# EAGLE board ALU (EAGLE 9.6.2), part 1 of 2
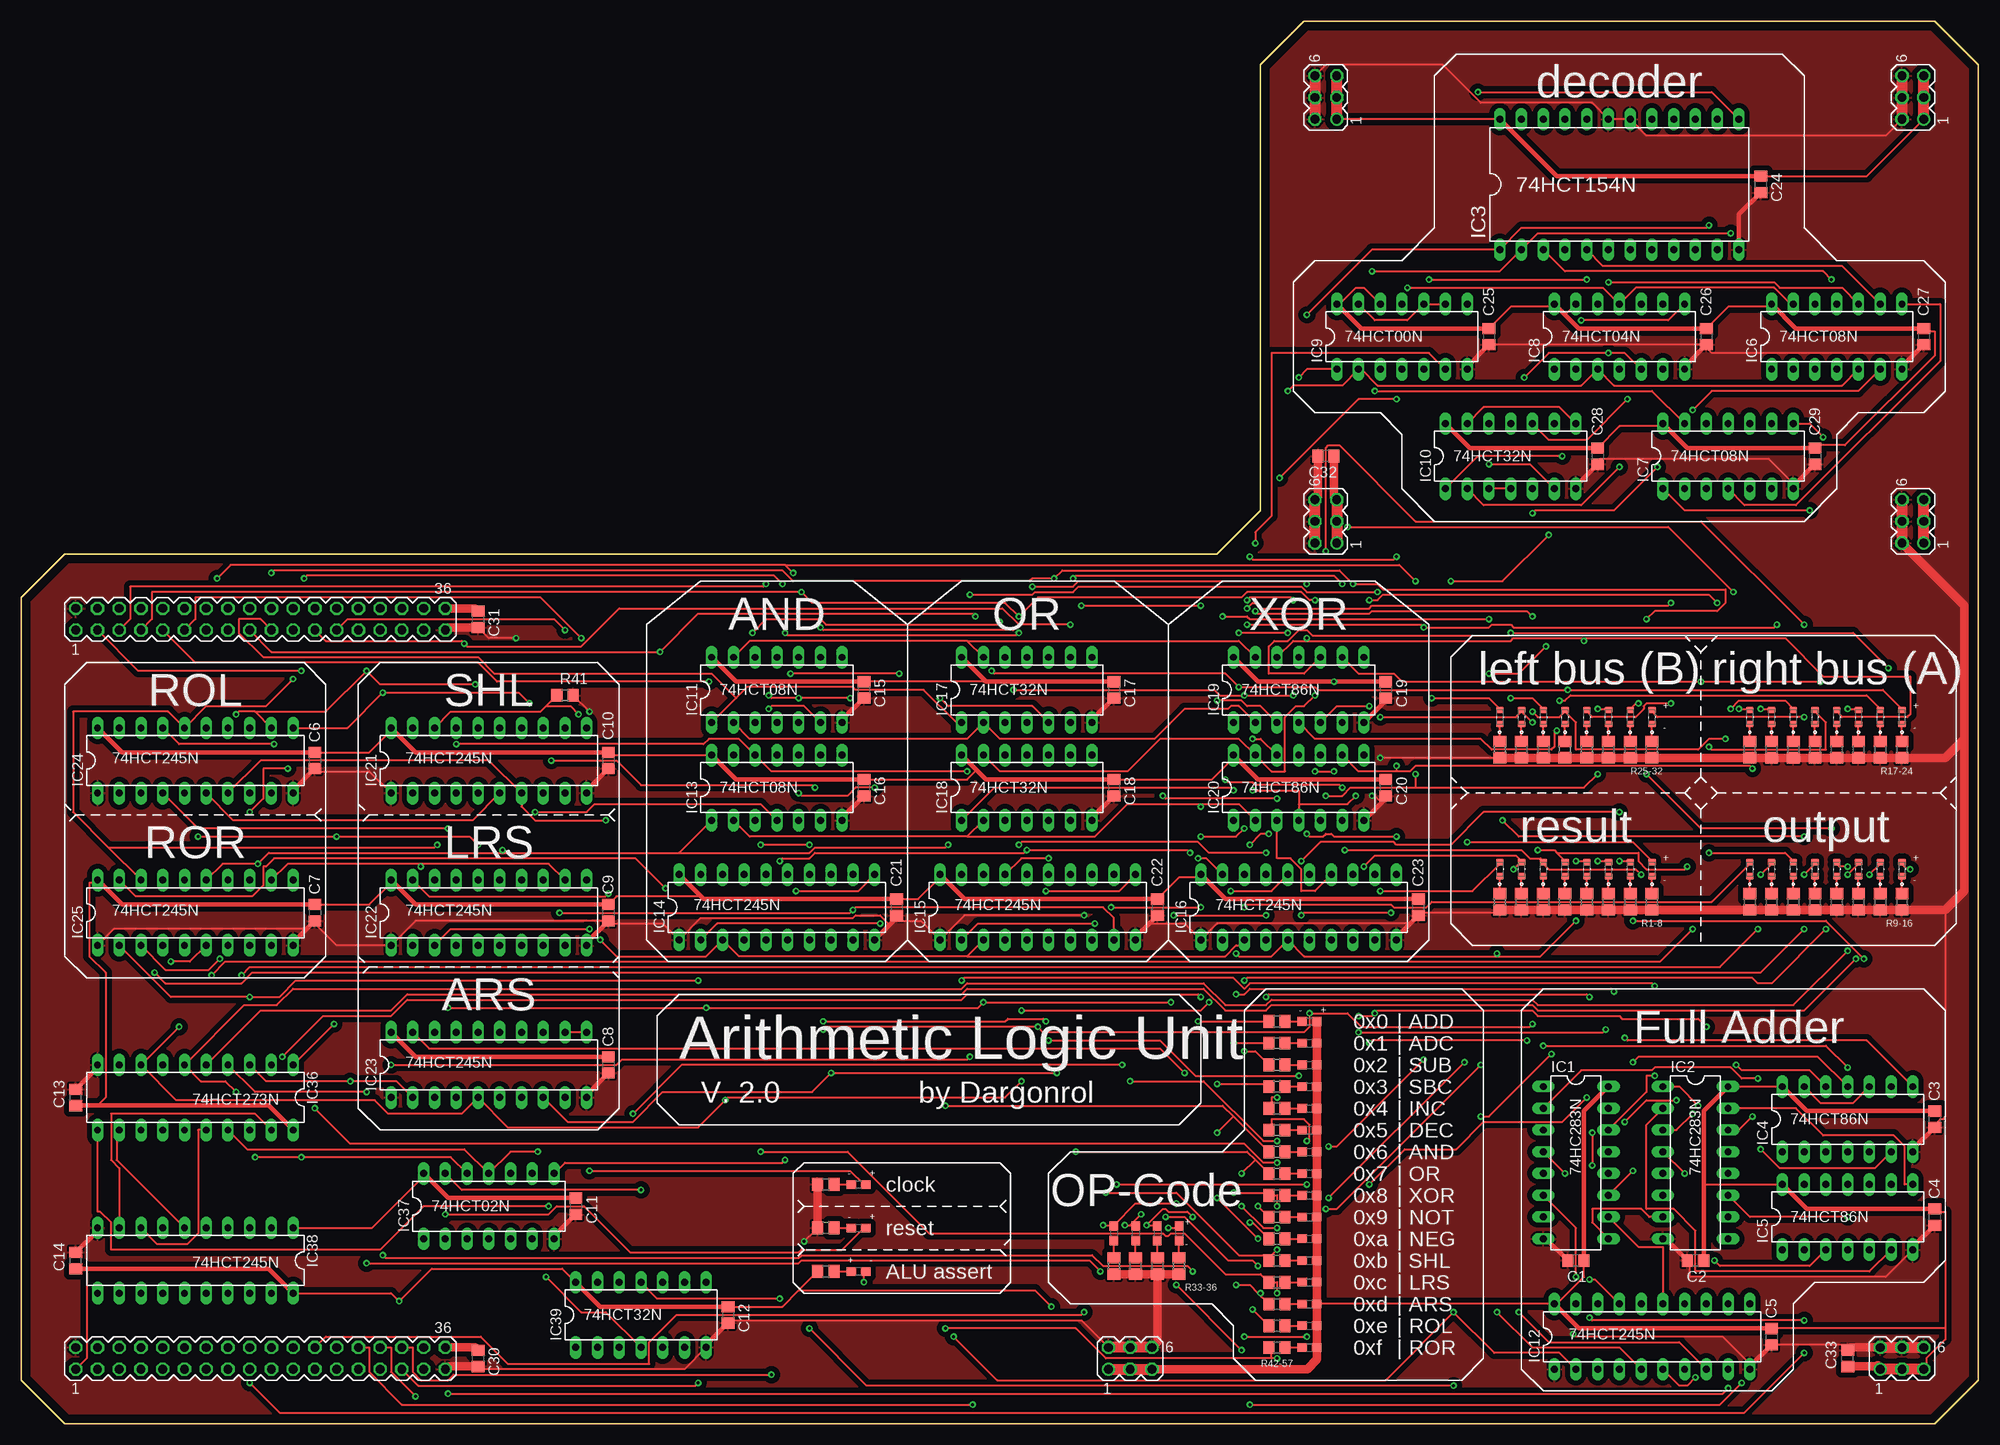
[diagram p9: board, top side]
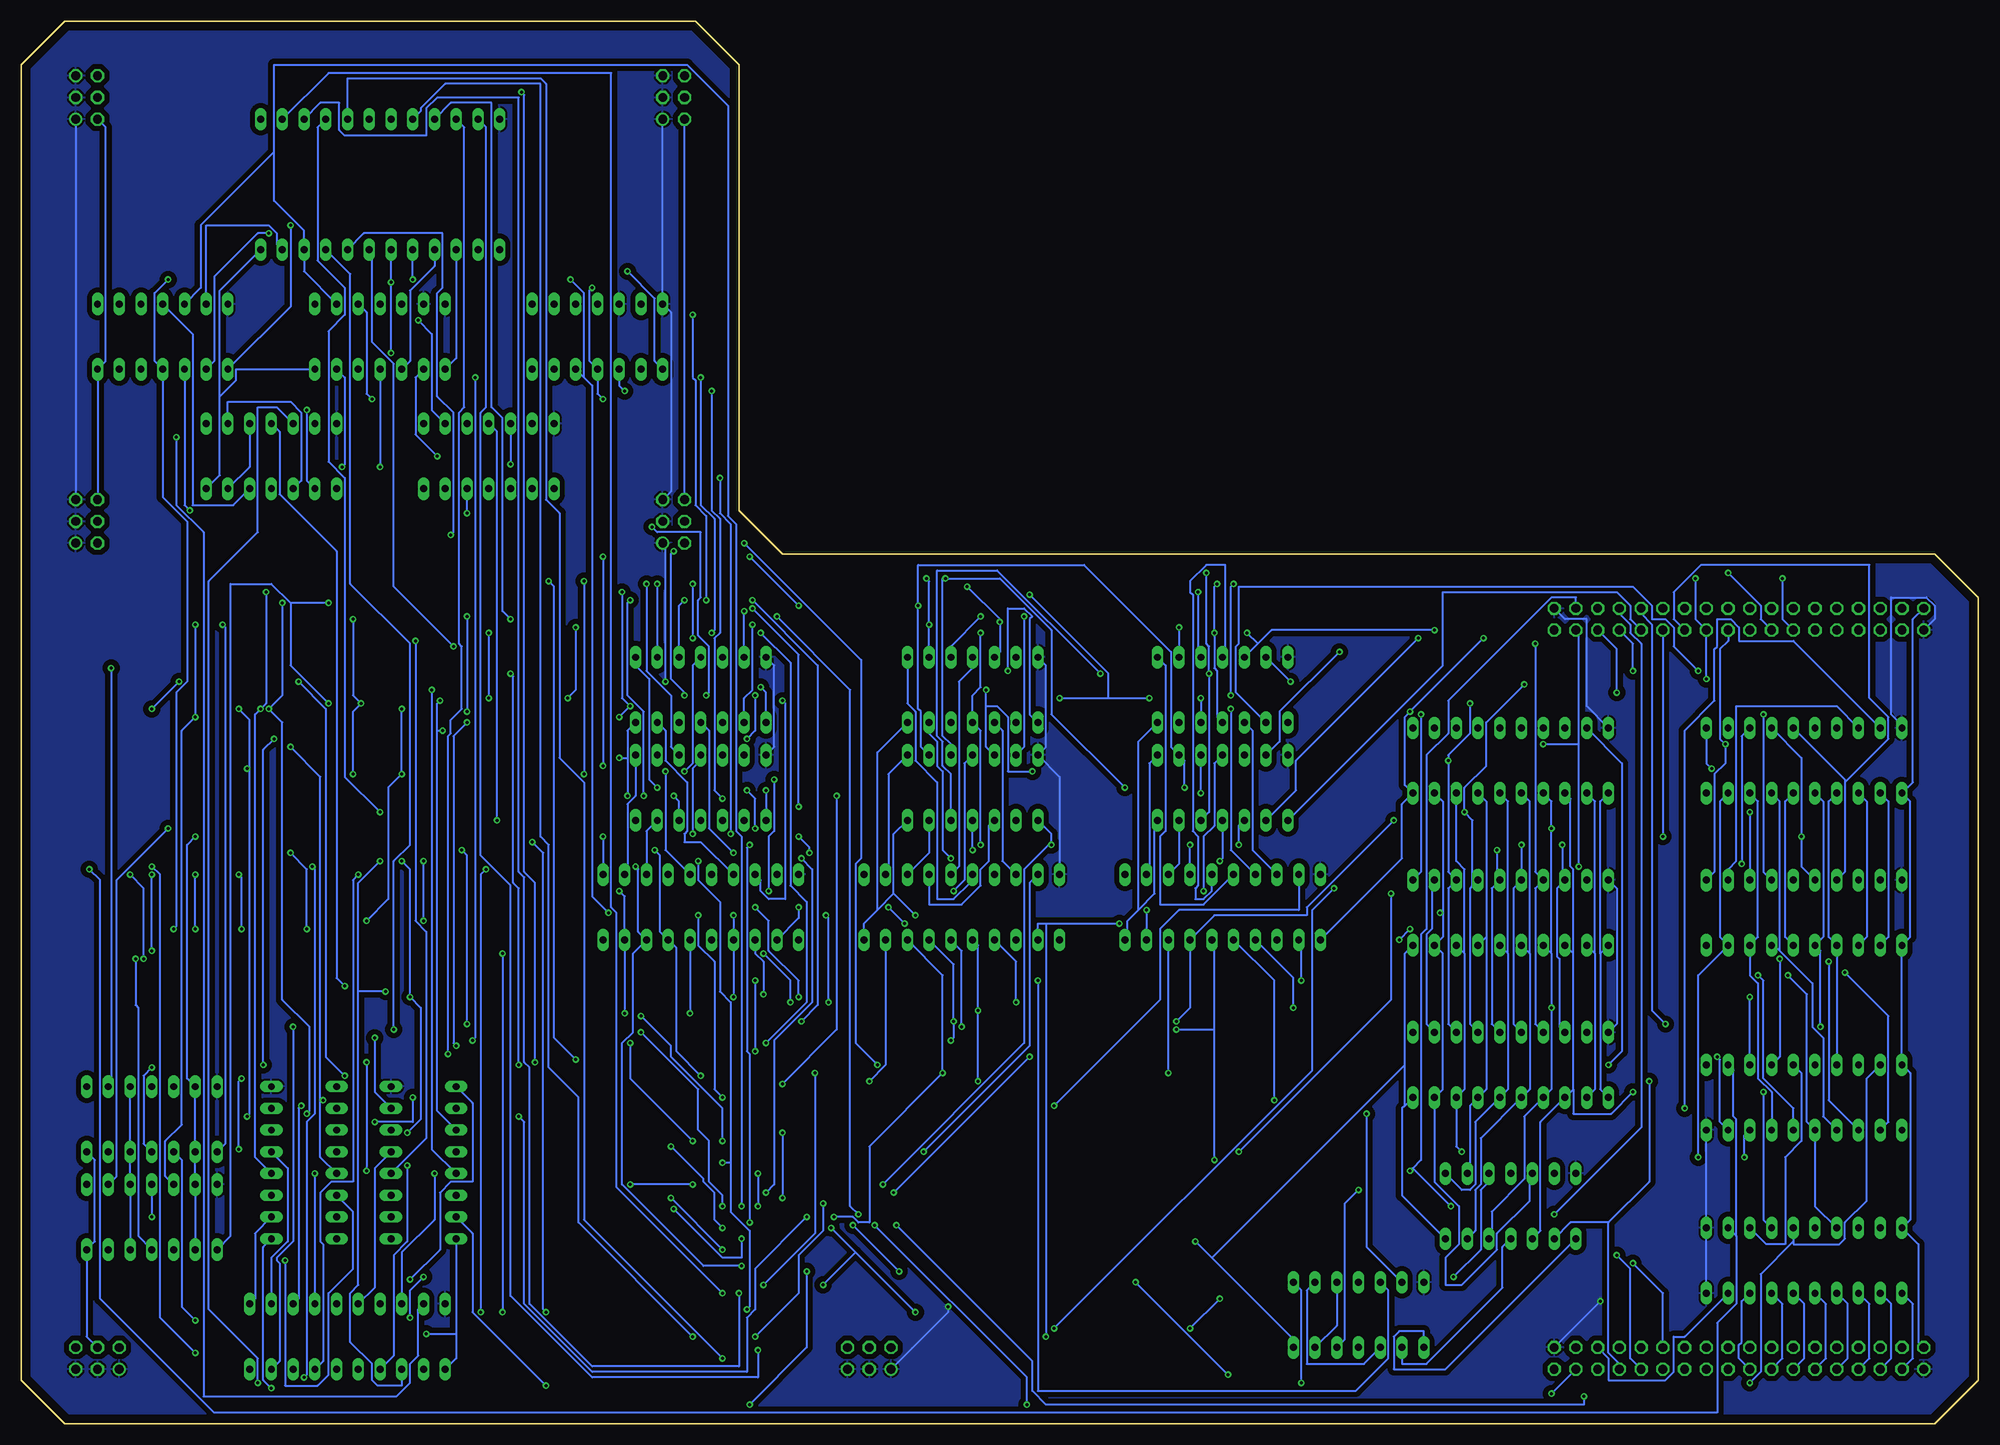
[diagram p10: board, bottom side, seen from below]

Size 228.6 x 163.83 mm. Coordinates in mm from the lower left corner, seen from the top.
Outline: 5.08,0 0,5.08 0,96.52 5.08,101.6 139.7,101.6 144.78,106.68 144.78,158.75 149.86,163.83 223.52,163.83 228.6,158.75 228.6,5.08 223.52,0 5.08,0
Copper layers (1*16): Top 0.035mm / dielectric 1.5mm / Bottom 0.035mm
Design rules "default *": minimum track width 10mil, minimum drill 0.35mm, track to track 6mil, track to pad 6mil, pad to pad 6mil, via to via 6mil, smd to smd 6mil, copper to edge 40mil, drill to drill 6mil, minimum pad ring 10mil, minimum via ring 8mil, stop-mask expansion 4mil, vias tented up to drill 0mil, thermal gap 10mil

## Footprints (pad centres in the part's own frame; a part is rotated, then mirrored left to right if it is on the bottom)
C0805 = smd 1.3 x 1.5: 1 -0.95,0; 2 0.95,0
LEDC1608X45N = smd 0.81 x 0.93: A 0.81,0; C -0.81,0
0603 = smd 1.1 x 1: 1 -0.85,0; 2 0.85,0
DIL16 = drill 0.813 long: 1 -8.89,-3.81; 2 -6.35,-3.81; 3 -3.81,-3.81; 4 -1.27,-3.81; 5 1.27,-3.81; 6 3.81,-3.81; 7 6.35,-3.81; 8 8.89,-3.81; 9 8.89,3.81; 10 6.35,3.81; 11 3.81,3.81; 12 1.27,3.81; 13 -1.27,3.81; 14 -3.81,3.81; 15 -6.35,3.81; 16 -8.89,3.81
DIL24-6 = drill 0.813 long: 1 -13.97,-7.62; 2 -11.43,-7.62; 3 -8.89,-7.62; 4 -6.35,-7.62; 5 -3.81,-7.62; 6 -1.27,-7.62; 7 1.27,-7.62; 8 3.81,-7.62; 9 6.35,-7.62; 10 8.89,-7.62; 11 11.43,-7.62; 12 13.97,-7.62; 13 13.97,7.62; 14 11.43,7.62; 15 8.89,7.62; 16 6.35,7.62; 17 3.81,7.62; 18 1.27,7.62; 19 -1.27,7.62; 20 -3.81,7.62; 21 -6.35,7.62; 22 -8.89,7.62; 23 -11.43,7.62; 24 -13.97,7.62
DIL14 = drill 0.813 long: 1 -7.62,-3.81; 2 -5.08,-3.81; 3 -2.54,-3.81; 4 0,-3.81; 5 2.54,-3.81; 6 5.08,-3.81; 7 7.62,-3.81; 8 7.62,3.81; 9 5.08,3.81; 10 2.54,3.81; 11 0,3.81; 12 -2.54,3.81; 13 -5.08,3.81; 14 -7.62,3.81
DIL20 = drill 0.813 long: 1 -11.43,-3.81; 2 -8.89,-3.81; 3 -6.35,-3.81; 4 -3.81,-3.81; 5 -1.27,-3.81; 6 1.27,-3.81; 7 3.81,-3.81; 8 6.35,-3.81; 9 8.89,-3.81; 10 11.43,-3.81; 11 11.43,3.81; 12 8.89,3.81; 13 6.35,3.81; 14 3.81,3.81; 15 1.27,3.81; 16 -1.27,3.81; 17 -3.81,3.81; 18 -6.35,3.81; 19 -8.89,3.81; 20 -11.43,3.81
R0805 = smd 1.3 x 1.5: 1 -0.95,0; 2 0.95,0
MA18-2 = drill 1.016 octagon: 1 -21.59,-1.27; 2 -21.59,1.27; 3 -19.05,-1.27; 4 -19.05,1.27; 5 -16.51,-1.27; 6 -16.51,1.27; 7 -13.97,-1.27; 8 -13.97,1.27; 9 -11.43,-1.27; 10 -11.43,1.27; 11 -8.89,-1.27; 12 -8.89,1.27; 13 -6.35,-1.27; 14 -6.35,1.27; 15 -3.81,-1.27; 16 -3.81,1.27; 17 -1.27,-1.27; 18 -1.27,1.27; 19 1.27,-1.27; 20 1.27,1.27; 21 3.81,-1.27; 22 3.81,1.27; 23 6.35,-1.27; 24 6.35,1.27; 25 8.89,-1.27; 26 8.89,1.27; 27 11.43,-1.27; 28 11.43,1.27; 29 13.97,-1.27; 30 13.97,1.27; 31 16.51,-1.27; 32 16.51,1.27; 33 19.05,-1.27; 34 19.05,1.27; 35 21.59,-1.27; 36 21.59,1.27
MA03-2 = drill 1.016: 1 -2.54,-1.27 | drill 1.016 octagon: 2 -2.54,1.27; 3 0,-1.27; 4 0,1.27; 5 2.54,-1.27; 6 2.54,1.27

## Placement (x,y rotation side)
C1  100pF  [C0805]  181.61,19.05 180 top
C2  100pF  [C0805]  195.58,19.05 180 top
C3  100pF  [C0805]  223.52,35.56 270 top
C4  100pF  [C0805]  223.52,24.13 270 top
C5  100pF  [C0805]  204.47,10.16 270 top
C6  100pF  [C0805]  34.29,77.47 270 top
C7  100pF  [C0805]  34.29,59.69 270 top
C8  100pF  [C0805]  68.58,41.91 270 top
C9  100pF  [C0805]  68.58,59.69 270 top
C10  100pF  [C0805]  68.58,77.47 270 top
C11  100pF  [C0805]  64.77,25.4 270 top
C12  100pF  [C0805]  82.55,12.7 270 top
C13  100pF  [C0805]  6.35,38.1 90 top
C14  100pF  [C0805]  6.35,19.05 90 top
C15  100pF  [C0805]  98.42,85.72 270 top
C16  100pF  [C0805]  98.42,74.3 270 top
C17  100pF  [C0805]  127.64,85.72 270 top
C18  100pF  [C0805]  127.64,74.3 270 top
C19  100pF  [C0805]  159.38,85.72 270 top
C20  100pF  [C0805]  159.38,74.3 270 top
C21  100pF  [C0805]  102.23,60.33 270 top
C22  100pF  [C0805]  132.72,60.33 270 top
C23  100pF  [C0805]  163.19,60.33 270 top
C24  100pF  [C0805]  203.2,144.78 270 top
C25  100pF  [C0805]  171.45,127 270 top
C26  100pF  [C0805]  196.85,127 270 top
C27  100pF  [C0805]  222.25,127 270 top
C28  100pF  [C0805]  184.15,113.03 270 top
C29  100pF  [C0805]  209.55,113.03 270 top
C30  1µF  [C0805]  53.34,7.62 270 top
C31  1µF  [C0805]  53.34,93.98 270 top
C32  1µF  [C0805]  152.4,113.03 180 top
C33  1µF  [C0805]  213.36,7.62 90 top
D1  LTST-C193KRKT-5A  [LEDC1608X45N]  190.5,64.77 90 top
D2  LTST-C193KRKT-5A  [LEDC1608X45N]  187.96,64.77 90 top
D3  LTST-C193KRKT-5A  [LEDC1608X45N]  185.42,64.77 90 top
D4  LTST-C193KRKT-5A  [LEDC1608X45N]  182.88,64.77 90 top
D5  LTST-C193KRKT-5A  [LEDC1608X45N]  180.34,64.77 90 top
D6  LTST-C193KRKT-5A  [LEDC1608X45N]  177.8,64.77 90 top
D7  LTST-C193KRKT-5A  [LEDC1608X45N]  175.26,64.77 90 top
D8  LTST-C193KRKT-5A  [LEDC1608X45N]  172.72,64.77 90 top
D9  LTST-C193KRKT-5A  [LEDC1608X45N]  219.71,64.77 90 top
D10  LTST-C193KRKT-5A  [LEDC1608X45N]  217.17,64.77 90 top
D11  LTST-C193KRKT-5A  [LEDC1608X45N]  214.63,64.77 90 top
D12  LTST-C193KRKT-5A  [LEDC1608X45N]  212.09,64.77 90 top
D13  LTST-C193KRKT-5A  [LEDC1608X45N]  209.55,64.77 90 top
D14  LTST-C193KRKT-5A  [LEDC1608X45N]  207.01,64.77 90 top
D15  LTST-C193KRKT-5A  [LEDC1608X45N]  204.47,64.77 90 top
D16  LTST-C193KRKT-5A  [LEDC1608X45N]  201.93,64.77 90 top
D17  LTST-C193KRKT-5A  [LEDC1608X45N]  219.71,82.55 90 top
D18  LTST-C193KRKT-5A  [LEDC1608X45N]  217.17,82.55 90 top
D19  LTST-C193KRKT-5A  [LEDC1608X45N]  214.63,82.55 90 top
D20  LTST-C193KRKT-5A  [LEDC1608X45N]  212.09,82.55 90 top
D21  LTST-C193KRKT-5A  [LEDC1608X45N]  209.55,82.55 90 top
D22  LTST-C193KRKT-5A  [LEDC1608X45N]  207.01,82.55 90 top
D23  LTST-C193KRKT-5A  [LEDC1608X45N]  204.47,82.55 90 top
D24  LTST-C193KRKT-5A  [LEDC1608X45N]  201.93,82.55 90 top
D25  LTST-C193KRKT-5A  [LEDC1608X45N]  172.72,82.55 90 top
D26  LTST-C193KRKT-5A  [LEDC1608X45N]  175.26,82.55 90 top
D27  LTST-C193KRKT-5A  [LEDC1608X45N]  177.8,82.55 90 top
D28  LTST-C193KRKT-5A  [LEDC1608X45N]  180.34,82.55 90 top
D29  LTST-C193KRKT-5A  [LEDC1608X45N]  182.88,82.55 90 top
D30  LTST-C193KRKT-5A  [LEDC1608X45N]  185.42,82.55 90 top
D31  LTST-C193KRKT-5A  [LEDC1608X45N]  187.96,82.55 90 top
D32  LTST-C193KRKT-5A  [LEDC1608X45N]  190.5,82.55 90 top
D33  LTST-C193TBKT-5A  [0603]  127.64,22.23 270 top
D34  LTST-C193TBKT-5A  [0603]  130.18,22.23 270 top
D35  LTST-C193TBKT-5A  [0603]  132.72,22.23 270 top
D36  LTST-C193TBKT-5A  [0603]  135.25,22.23 270 top
D37  LTST-C193TBKT-5A  [0603]  97.79,27.94 0 top
D38  LTST-C193TBKT-5A  [0603]  97.79,22.86 0 top
D40  LTST-C193TBKT-5A  [0603]  97.79,17.78 180 top
D41  LTST-C193TBKT-5A  [0603]  150.5,46.99 0 top
D42  LTST-C193TBKT-5A  [0603]  150.5,44.45 0 top
D43  LTST-C193TBKT-5A  [0603]  150.5,41.91 0 top
D44  LTST-C193TBKT-5A  [0603]  150.5,39.37 0 top
D45  LTST-C193TBKT-5A  [0603]  150.5,36.83 0 top
D46  LTST-C193TBKT-5A  [0603]  150.5,34.29 0 top
D47  LTST-C193TBKT-5A  [0603]  150.5,31.75 0 top
D48  LTST-C193TBKT-5A  [0603]  150.5,29.21 0 top
D49  LTST-C193TBKT-5A  [0603]  150.5,26.67 0 top
D50  LTST-C193TBKT-5A  [0603]  150.5,24.13 0 top
D51  LTST-C193TBKT-5A  [0603]  150.5,21.59 0 top
D52  LTST-C193TBKT-5A  [0603]  150.5,19.05 0 top
D53  LTST-C193TBKT-5A  [0603]  150.5,16.51 0 top
D54  LTST-C193TBKT-5A  [0603]  150.5,13.97 0 top
D55  LTST-C193TBKT-5A  [0603]  150.5,11.43 0 top
D56  LTST-C193TBKT-5A  [0603]  150.5,8.89 0 top
IC1  74HC283N  [DIL16]  181.61,30.48 270 top
IC2  74HC283N  [DIL16]  195.58,30.48 270 top
IC3  74HCT154N  [DIL24-6]  186.69,144.78 0 top
IC4  74HCT86N  [DIL14]  213.36,35.56 0 top
IC5  74HCT86N  [DIL14]  213.36,24.13 0 top
IC6  74HCT08N  [DIL14]  212.09,127 0 top
IC7  74HCT08N  [DIL14]  199.39,113.03 0 top
IC8  74HCT04N  [DIL14]  186.69,127 0 top
IC9  74HCT00N  [DIL14]  161.29,127 0 top
IC10  74HCT32N  [DIL14]  173.99,113.03 0 top
IC11  74HCT08N  [DIL14]  88.27,85.72 0 top
IC12  74HCT245N  [DIL20]  190.5,10.16 0 top
IC13  74HCT08N  [DIL14]  88.27,74.3 0 top
IC14  74HCT245N  [DIL20]  88.27,60.33 0 top
IC15  74HCT245N  [DIL20]  118.75,60.33 0 top
IC16  74HCT245N  [DIL20]  149.22,60.33 0 top
IC17  74HCT32N  [DIL14]  117.47,85.72 0 top
IC18  74HCT32N  [DIL14]  117.47,74.3 0 top
IC19  74HCT86N  [DIL14]  149.22,85.72 0 top
IC20  74HCT86N  [DIL14]  149.22,74.3 0 top
IC21  74HCT245N  [DIL20]  54.61,77.47 0 top
IC22  74HCT245N  [DIL20]  54.61,59.69 0 top
IC23  74HCT245N  [DIL20]  54.61,41.91 0 top
IC24  74HCT245N  [DIL20]  20.32,77.47 0 top
IC25  74HCT245N  [DIL20]  20.32,59.69 0 top
IC36  74HCT273N  [DIL20]  20.32,38.1 180 top
IC37  74HCT02N  [DIL14]  54.61,25.4 0 top
IC38  74HCT245N  [DIL20]  20.32,19.05 180 top
IC39  74HCT32N  [DIL14]  72.39,12.7 0 top
R1  1600  [R0805]  190.5,60.96 270 top
R2  1600  [R0805]  187.96,60.96 270 top
R3  1600  [R0805]  185.42,60.96 270 top
R4  1600  [R0805]  182.88,60.96 270 top
R5  1600  [R0805]  180.34,60.96 270 top
R6  1600  [R0805]  177.8,60.96 270 top
R7  1600  [R0805]  175.26,60.96 270 top
R8  1600  [R0805]  172.72,60.96 270 top
R9  1600  [R0805]  219.71,60.96 270 top
R10  1600  [R0805]  217.17,60.96 270 top
R11  1600  [R0805]  214.63,60.96 270 top
R12  1600  [R0805]  212.09,60.96 270 top
R13  1600  [R0805]  209.55,60.96 270 top
R14  1600  [R0805]  207.01,60.96 270 top
R15  1600  [R0805]  204.47,60.96 270 top
R16  1600  [R0805]  201.93,60.96 270 top
R17  1600  [R0805]  219.71,78.74 270 top
R18  1600  [R0805]  217.17,78.74 270 top
R19  1600  [R0805]  214.63,78.74 270 top
R20  1600  [R0805]  212.09,78.74 270 top
R21  1600  [R0805]  209.55,78.74 270 top
R22  1600  [R0805]  207.01,78.74 270 top
R23  1600  [R0805]  204.47,78.74 270 top
R24  1600  [R0805]  201.93,78.74 270 top
R25  1600  [R0805]  172.72,78.74 270 top
R26  1600  [R0805]  175.26,78.74 270 top
R27  1600  [R0805]  177.8,78.74 270 top
R28  1600  [R0805]  180.34,78.74 270 top
R29  1600  [R0805]  182.88,78.74 270 top
R30  1600  [R0805]  185.42,78.74 270 top
R31  1600  [R0805]  187.96,78.74 270 top
R32  1600  [R0805]  190.5,78.74 270 top
R33  560  [R0805]  127.64,18.41 270 top
R34  560  [R0805]  130.18,18.41 270 top
R35  560  [R0805]  132.72,18.41 270 top
R36  560  [R0805]  135.25,18.41 270 top
R37  560  [R0805]  93.98,27.94 180 top
R38  560  [R0805]  93.98,22.86 180 top
R40  560  [R0805]  93.98,17.78 180 top
R41  PULL DOWN  [R0805]  63.5,85.09 0 top
R42  560  [R0805]  146.69,46.99 0 top
R43  560  [R0805]  146.69,44.45 0 top
R44  560  [R0805]  146.69,41.91 0 top
R45  560  [R0805]  146.69,39.37 0 top
R46  560  [R0805]  146.69,36.83 0 top
R47  560  [R0805]  146.69,34.29 0 top
R48  560  [R0805]  146.69,31.75 0 top
R49  560  [R0805]  146.69,29.21 0 top
R50  560  [R0805]  146.69,26.67 0 top
R51  560  [R0805]  146.69,24.13 0 top
R52  560  [R0805]  146.69,21.59 0 top
R53  560  [R0805]  146.69,19.05 0 top
R54  560  [R0805]  146.69,16.51 0 top
R55  560  [R0805]  146.69,13.97 0 top
R56  560  [R0805]  146.69,11.43 0 top
R57  560  [R0805]  146.69,8.89 0 top
SV_ALU_1  [MA18-2]  27.94,93.98 0 top
SV_ALU_2  [MA18-2]  27.94,7.62 0 top
SV_ALU_SUP1  [MA03-2]  152.4,154.94 90 top
SV_ALU_SUP2  [MA03-2]  220.98,154.94 90 top
SV_ALU_SUP3  [MA03-2]  152.4,105.41 90 top
SV_ALU_SUP4  [MA03-2]  129.54,7.62 0 top
SV_ALU_SUP5  [MA03-2]  219.71,7.62 0 top
SV_ALU_SUP6  [MA03-2]  220.98,105.41 90 top

## Tracks (layer width: path | path; a pad name or v marks a point on that pad's centre or on a via)
!CTRL_ALU_ASSERT  (via drill 0.35)
  Top 0.254: v98.42,16.51 98.42,17.78 D40.1 | v87.63,5.71 50.48,5.71 49.85,5.08 46.67,5.08 45.72,6.03 45.72,8.89 SV_ALU_2.32
  Bottom 0.254: v87.63,5.71 v98.42,16.51 | IC38.19 34.29,10.16 35.56,10.16 35.56,6.03 36.51,5.08 43.18,5.08 43.18,7.62 SV_ALU_2.32
ADC  (via drill 0.35)
  Top 0.254: v141.6,44.45 R43.1 | v147.96,92.39 v142.24,92.39 | v149.22,122.24 150.18,123.19 IC9.1 | v157.8,134.62 172.72,134.62 IC3.2 177.16,139.06 v199.71,139.06
  Bottom 0.254: v141.6,44.45 136.84,49.21 136.84,60.96 138.75,62.87 138.75,88.9 v142.24,92.39 | v147.96,92.39 147.64,92.71 147.64,105.73 149.22,107.31 v149.22,122.24 | v157.8,134.62 154.62,131.44 154.62,124.14 IC9.1 | IC6.2 206.06,124.14 206.06,133.99 200.98,139.06 v199.71,139.06
ADD  (via drill 0.35)
  Top 0.254: v137.48,46.99 R42.1 | v143.19,96.2 143.51,96.52 148.27,96.52 v148.59,96.2 | v150.18,129.54 157.8,137.16 IC3.1 175.26,139.7 196.85,139.7 v197.17,140.02
  Bottom 0.254: v137.48,46.99 135.57,48.9 135.57,88.58 v143.19,96.2 | v148.59,96.2 148.59,106.05 149.86,107.31 149.86,121.92 150.18,122.24 v150.18,129.54 | IC6.1 197.17,130.49 v197.17,140.02
ALU_CARRY_FLAG  (via drill 0.35)
  Top 0.254: v199.39,4.13 198.75,3.49 v49.85,3.49
  Bottom 0.254: IC2.9 200.34,20.64 200.34,5.08 v199.39,4.13 | SV_ALU_2.33 v49.85,3.49
ALU_SIGN_FLAG  (via drill 0.35)
  Top 0.254: v168.91,67.94 188.28,67.94 190.5,65.72 D1.A | IC12.2 179.71,8.26 172.09,8.26 v167.32,13.02 159.38,5.08 113.98,5.08 v108.9,10.16 | IC14.2 81.28,58.42 v100.33,58.42 | v127.32,60.33 v137.79,60.33 | v125.41,58.42 111.76,58.42 IC15.2 | IC36.3 28.57,40.01 v38.42,40.01 43.81,40.01 IC23.2 | IC25.2 17.46,49.85 v26.67,49.85 30.16,49.85 32.07,51.75 v79.06,51.75
  Bottom 0.254: v168.91,67.94 167.64,66.67 167.64,13.34 v167.32,13.02 | 108.9,58.42 109.86,58.42 IC15.2 | 108.9,58.42 v100.33,58.42 | IC16.2 137.79,59.05 v137.79,60.33 | v125.41,58.42 v127.32,60.33 | IC37.2 47.62,23.5 43.18,23.5 | 43.18,23.5 43.18,8.26 41.91,6.99 SV_ALU_2.29 | IC25.2 10.48,56.83 10.48,72.71 IC24.2 | IC23.2 44.77,39.05 44.77,54.93 | IC22.2 44.77,54.93 | IC21.2 44.77,72.71 44.77,54.93 | IC36.3 v26.67,49.85 | 43.18,23.5 38.42,28.26 v38.42,40.01 | IC14.2 79.06,56.2 v79.06,51.75 | 108.9,58.42 v108.9,10.16
ALU_ZERO_FLAG  (via drill 0.35)
  Top 0.254: v79.06,4.76 78.74,4.45 46.35,4.45 SV_ALU_2.31
  Bottom 0.254: IC39.8 79.06,15.56 v79.06,4.76
AND  (via drill 0.35)
  Top 0.254: 141.6,35.88 140.34,37.15 v107.95,37.15 | 141.6,35.88 R48.1 | v178.12,90.81 174.94,87.63 v171.45,87.63 | v170.5,41.91 153.67,25.08 v152.4,25.08 | v139.7,26.35 v144.46,21.59 | 141.6,35.88 v139.7,33.97
  Bottom 0.254: v107.95,37.15 95.57,49.53 95.57,57.78 93.34,60.01 79.38,60.01 IC14.19 | IC3.7 187.64,136.84 187.64,126.36 185.1,123.83 185.1,97.79 v178.12,90.81 | v171.45,87.63 171.13,87.31 171.13,63.18 170.5,62.55 v170.5,41.91 | v152.4,25.08 146.69,19.37 144.46,19.37 v144.46,21.59 | v139.7,33.97 v139.7,26.35
ARS  (via drill 0.35)
  Top 0.254: 144.46,15.24 143.51,16.19 v141.92,16.19 | 144.46,15.24 R55.1 | v135.89,40.96 133.03,43.81 47.62,43.81 IC23.19 | 144.46,15.24 v144.78,15.24
  Bottom 0.254: v141.92,16.19 135.89,22.23 v135.89,40.96 | IC3.15 193.68,154.31 191.45,154.31 191.45,151.13 190.82,150.5 181.29,150.5 181.29,153.67 180.02,154.94 170.5,154.94 170.5,64.45 169.86,63.82 169.86,42.23 169.23,41.59 169.23,13.97 161.93,6.67 144.78,6.67 v144.78,15.24
BUS_!RESET  (via drill 0.35)
  Top 0.254: v36.51,46.67 IC36.1
  Bottom 0.254: v36.51,46.67 38.1,48.26 38.1,93.34 39.37,94.61 SV_ALU_1.28
BUS_CARRY_FLAG  (via drill 0.35)
  Top 0.254: v200.98,4.76 198.44,2.22 v143.51,2.22 | v136.84,17.78 136.21,18.41 126.36,18.41 125.09,19.68 91.12,19.68 90.81,19.37 42.55,19.37 v42.23,19.68
  Bottom 0.254: IC7.12 198.75,118.75 200.98,118.75 200.98,104.14 206.69,98.42 206.69,13.34 200.98,7.62 v200.98,4.76 | v143.51,2.22 136.84,8.89 v136.84,17.78 | v42.23,19.68 40.64,18.1 40.64,7.62 SV_ALU_2.27
BUS_CLK  (via drill 0.35)
  Top 0.254: v66.36,29.53 96.84,29.53 98.42,27.94 D37.2 | IC36.11 8.89,24.77 9.21,24.77 10.48,23.5 10.48,20.32 41.91,20.32 46.99,25.4 v61.59,25.4
  Bottom 0.254: 66.04,29.84 65.09,30.8 65.09,57.15 64.45,57.78 64.45,78.11 61.91,80.64 61.91,84.45 49.85,96.52 46.99,96.52 SV_ALU_1.34 | 66.04,29.84 v66.36,29.53 | 66.04,29.84 v61.59,25.4
BUS_MAIN_BUS_0
  Bottom 0.254: IC38.18 27.62,14.29 27.62,9.53 27.94,9.21 27.94,7.62 SV_ALU_2.17
BUS_MAIN_BUS_1
  Bottom 0.254: IC38.17 22.86,13.97 22.86,7.62 SV_ALU_2.15
BUS_MAIN_BUS_2
  Bottom 0.254: IC38.16 20.32,13.97 20.32,7.62 SV_ALU_2.13
BUS_MAIN_BUS_3
  Bottom 0.254: IC38.15 17.78,13.97 17.78,7.62 SV_ALU_2.11
BUS_MAIN_BUS_4
  Bottom 0.254: IC38.14 15.24,13.97 15.24,7.62 SV_ALU_2.9
BUS_MAIN_BUS_5
  Bottom 0.254: IC38.13 12.7,13.97 12.7,7.62 SV_ALU_2.7
BUS_MAIN_BUS_6
  Bottom 0.254: IC38.12 10.16,13.97 10.16,7.62 SV_ALU_2.5
BUS_MAIN_BUS_7
  Bottom 0.254: IC38.11 7.62,13.97 7.62,7.62 SV_ALU_2.3
BUS_RESET  (via drill 0.35)
  Top 0.254: v49.53,24.45 61.59,24.45 62.55,25.4 65.72,25.4 71.12,20 90.81,20 91.12,20.32 95.89,20.32 98.42,22.86 D38.2
  Bottom 0.254: v49.53,24.45 39.37,34.61 39.37,91.12 40.64,92.39 40.64,93.34 41.91,94.61 SV_ALU_1.30
CTRL25_ALU_OP_1  (via drill 0.35)
  Top 0.254: v133.99,22.86 135.25,22.86 D36.1 | v124.14,13.02 123.83,12.7 76.52,12.7 73.34,9.53 73.34,6.99 56.83,6.99 53.66,10.16 35.56,10.16 SV_ALU_2.24 | v134.94,16.19 v142.56,8.57
  Bottom 0.254: v124.14,13.02 131.13,20 | 131.13,20 v133.99,22.86 | IC3.23 174.31,151.45 174.31,118.75 174.94,118.11 174.94,66.36 171.45,62.87 171.45,14.92 161.93,5.4 142.56,5.4 v142.56,8.57 | 131.13,20 v134.94,16.19
CTRL26_ALU_OP_2  (via drill 0.35)
  Top 0.254: v126.05,17.78 124.78,19.05 91.12,19.05 90.81,18.73 v40.32,18.73 | D35.1 132.72,23.18 v131.44,23.18 133.35,25.08 133.67,25.08 133.99,24.77 136.21,24.77 v136.84,24.13 | v178.75,43.18 171.45,35.88 v170.5,35.88
  Bottom 0.254: v126.05,17.78 v131.44,23.18 | v40.32,18.73 36.83,15.24 SV_ALU_2.26 | IC3.22 176.85,151.45 176.85,118.75 177.48,118.11 177.48,91.12 177.16,90.81 177.16,83.5 178.44,82.23 178.44,80.64 178.75,80.33 v178.75,43.18 | v170.5,35.88 169.86,35.24 169.86,13.97 161.93,6.03 143.83,6.03 143.83,12.38 142.88,13.34 142.88,18.1 v136.84,24.13
CTRL27_ALU_OP_3  (via drill 0.35)
  Top 0.254: v128.91,23.18 129.54,23.18 | 129.54,23.18 130.18,23.18 D34.1 | v111.12,2.22 44.45,2.22 40.64,6.03 40.64,8.89 SV_ALU_2.28 | v171.45,93.98 143.51,93.98 143.19,94.3 v140.34,94.3 | 129.54,23.18 v130.81,24.45
  Bottom 0.254: v128.91,23.18 111.12,5.4 v111.12,2.22 | IC3.21 178.44,154.31 173.67,154.31 173.67,118.75 172.4,117.47 172.4,94.93 v171.45,93.98 | v140.34,94.3 131.76,85.72 131.76,25.4 v130.81,24.45
CTRL28_ALU_OP_4  (via drill 0.35)
  Top 0.254: v126.36,23.18 127.64,23.18 | v46.04,3.17 43.18,6.03 43.18,8.89 SV_ALU_2.30 | v142.88,10.16 v150.18,10.16 | v134.94,25.72 130.18,25.72 127.64,23.18 | 127.64,23.18 D33.1
  Bottom 0.254: v126.36,23.18 110.49,7.3 110.49,3.81 108.9,2.22 46.04,2.22 v46.04,3.17 | IC3.20 181.93,153.35 181.93,153.67 179.07,156.53 167.96,156.53 167.96,68.58 167,67.63 167,41.59 163.51,38.1 163.51,23.5 v150.18,10.16 | v142.88,10.16 137.79,15.24 137.79,19.68 134.94,22.54 v134.94,25.72
DEC  (via drill 0.35)
  Top 0.254: v150.18,33.02 150.5,33.02 150.5,34.92 149.86,35.56 146.05,35.56 146.05,34.29 R47.1 | v157.48,44.45 157.8,44.77 v175.9,44.77 | v175.58,122.24 178.44,125.09 v185.42,125.09 187.32,125.09 IC8.5 | IC6.10 212.72,132.72 205.42,132.72 204.79,133.35 v185.42,133.35
  Bottom 0.254: v150.18,33.02 157.48,40.32 v157.48,44.45 | v175.9,44.77 175.58,45.09 v175.58,122.24 | v185.42,125.09 v185.42,133.35 IC3.6
GND  (via drill 0.35)
  Top 0.254: v91.44,21.27 92.71,22.54 R38.2 | IC39.7 77.47,6.35 53.66,6.35 C30.2 | SV_ALU_SUP4.2 123.83,12.06 82.55,12.06 C12.2 | IC21.1 40.64,76.2 34.29,76.2 C6.2 | C7.2 34.29,58.42 36.83,55.88 IC22.1 46.04,58.74 68.26,58.74 C9.2 68.58,58.42 74.93,58.42 IC14.1 79.38,59.05 97.16,59.05 97.47,59.37 100.33,59.37 101.44,58.26 | C21.2 102.23,58.74 105.09,58.74 IC15.1 110.17,59.37 v124.14,59.37 | v66.36,83.19 R41.2 | v57.78,91.76 54.61,91.76 53.66,92.71 C31.2 | IC25.1 10.79,57.78 33.02,57.78 33.18,57.63 | C5.2 213.36,9.21 C33.2 | IC5.7 217.81,17.14 194.94,17.14 194.94,19.05 C2.2 | v181.29,10.48 181.61,10.16 198.75,10.16 201.93,6.99 IC12.10 | C25.2 196.53,126.05 C26.2 196.85,125.73 197.49,125.09 220.98,125.09 221.14,124.94 | C28.2 184.15,112.39 184.47,112.71 204.15,112.71 207.01,109.86 IC7.7 | 131.92,58.58 132.08,58.42 135.89,58.42 IC16.1 139.7,58.42 161.93,58.42 162.08,58.26 | SV_ALU_SUP2.2 217.81,150.5 189.87,150.5 IC3.18 IC3.19 183.51,154.31 170.5,154.31 166.05,158.75 152.4,158.75 SV_ALU_SUP1.6 | v157.8,73.34 158.12,73.34 158.75,72.71 C20.2 | C23.2 163.19,59.69 172.4,59.69 R8.2 | v158.75,77.79 172.4,77.79 R25.2 | C3.2 223.52,34.92 224.16,35.56 224.47,35.56 224.79,35.88 224.79,59.69 224.78,60.01
  Top 0.508: C14.2 8.89,22.54 IC38.10 | C13.2 8.89,41.59 IC36.10 | C7.2 33.18,57.63 31.75,56.2 IC25.10 | C9.2 66.04,56.2 IC22.10 | C21.2 102.23,59.05 101.44,58.26 IC14.10 | C22.2 131.92,58.58 130.18,56.84 IC15.10 | C23.2 162.08,58.26 160.66,56.84 IC16.10 | C20.2 159.38,73.03 IC20.7 | C19.2 159.38,84.45 IC19.7 | C18.2 125.09,70.81 IC18.7 | C17.2 125.09,82.23 IC17.7 | C15.2 95.89,82.23 IC11.7 | C16.2 95.89,70.81 IC13.7 | C10.2 66.04,73.98 IC21.10 | C6.2 31.75,73.98 IC24.10 | C8.2 66.04,38.42 IC23.10 | C11.2 62.23,21.91 IC37.7 | C12.2 80.01,9.21 IC39.7 | C5.2 201.93,6.67 IC12.10 | C4.2 220.98,20.64 IC5.7 | C3.2 220.98,32.07 IC4.7 | C2.2 192.09,21.59 IC2.8 | C1.2 178.12,21.59 IC1.8 | C29.2 207.01,109.54 IC7.7 | C28.2 181.61,109.54 IC10.7 | C25.2 168.91,123.51 IC9.7 | C26.2 194.31,123.51 IC8.7 | C27.2 221.14,124.94 219.71,123.51 IC6.7 | C24.2 200.66,141.29 IC3.12
  Top 1.016: R33.2 R34.2 R35.2 | R35.2 R36.2 | R35.2 132.72,9.53 SV_ALU_SUP4.6 | R8.2 R7.2 R6.2 R5.2 R4.2 R3.2 R2.2 R1.2 R16.2 R15.2 R14.2 R13.2 R12.2 R11.2 R10.2 R9.2 224.78,60.01 227,62.23 227,80 | R25.2 R26.2 R27.2 R28.2 R29.2 R30.2 R31.2 R32.2 R24.2 R23.2 R22.2 R21.2 R20.2 R19.2 R18.2 R17.2 224.79,77.79 227,80 | SV_ALU_SUP6.2 227,95.58 227,80 | R38.2 R37.2 | C30.2 49.85,6.67 SV_ALU_2.35 | C31.2 49.85,93.03 SV_ALU_1.35 | C32.2 151.45,108.27 SV_ALU_SUP3.6 | C33.2 213.68,8.89 SV_ALU_SUP5.2
  Top 1.27: SV_ALU_SUP1.6 SV_ALU_SUP1.4 SV_ALU_SUP1.2 | SV_ALU_SUP2.6 SV_ALU_SUP2.4 SV_ALU_SUP2.2 | SV_ALU_SUP6.6 SV_ALU_SUP6.4 SV_ALU_SUP6.2 | SV_ALU_SUP5.2 SV_ALU_SUP5.4 SV_ALU_SUP5.6 | SV_ALU_SUP4.6 SV_ALU_SUP4.4 SV_ALU_SUP4.2 | SV_ALU_SUP3.2 SV_ALU_SUP3.4 SV_ALU_SUP3.6
  Bottom 0.254: SV_ALU_2.2 6.99,9.53 6.99,20.95 IC38.10 7.94,23.81 7.94,40.96 IC36.10 IC25.1 7.94,56.83 7.94,72.71 IC24.1 7.62,74.93 7.62,93.98 SV_ALU_1.2 | 89.53,19.37 80.01,9.84 IC39.7 | 89.53,19.37 v91.44,21.27 | IC23.1 44.13,39.05 44.13,54.93 | IC22.1 44.13,54.93 | IC21.1 44.13,72.71 44.13,54.93 | IC13.7 96.2,70.17 96.2,61.91 98.11,60.01 | 98.11,60.01 99.38,58.74 99.38,56.83 IC14.10 | IC11.7 98.11,79.69 98.11,60.01 | v57.78,91.76 v66.36,83.19 66.99,82.55 66.99,74.61 IC21.10 67.31,72.39 67.31,66.04 IC14.1 | IC37.7 67.31,26.67 67.31,36.83 66.99,37.15 | IC23.10 66.99,37.15 | IC22.10 66.99,54.93 66.99,41.91 | 66.99,37.15 66.99,41.91 | 66.99,41.91 89.53,19.37 | IC12.1 177.8,7.62 177.8,10.48 | IC1.8 177.8,10.48 | SV_ALU_SUP5.4 220.98,10.16 IC5.7 220.03,21.27 220.03,30.8 IC4.7 | v181.29,10.48 177.8,10.48 | IC3.12 205.42,132.4 205.42,120.02 | 205.42,120.02 205.42,110.81 IC7.7 | IC8.7 203.52,123.19 203.52,121.92 205.42,120.02 | SV_ALU_SUP3.6 SV_ALU_SUP1.2 | IC18.7 126.68,68.9 126.68,61.91 | 128.59,60.01 130.18,58.42 IC15.10 | 128.59,60.01 126.68,61.91 | IC17.7 128.59,78.42 128.59,60.01 | 157.8,77.79 157.8,80.96 IC19.7 | 157.8,77.79 v157.8,73.34 | SV_ALU_SUP6.6 IC6.7 218.76,124.14 218.76,151.45 SV_ALU_SUP2.2 | v158.75,77.79 157.8,77.79 | 126.68,61.91 v124.14,59.37
  pour Top (isolate 0.61): -2.54,96.52 5.08,104.14 138.43,104.14 142.24,107.95 142.24,158.75 149.86,166.37 223.52,166.37 231.14,158.75 231.14,5.08 223.52,-2.54 5.08,-2.54 -2.54,5.08
INC  (via drill 0.35)
  Top 0.254: IC3.5 184.78,135.25 212.72,135.25 IC6.9 | v146.69,38.1 146.05,38.1 146.05,36.83 R46.1 | v149.54,59.37 149.86,59.69 v160.02,59.69 | v164.47,133.67 v182.88,133.67
  Bottom 0.254: v146.69,38.1 147.64,39.05 147.64,53.98 149.54,55.88 v149.54,59.37 | v160.02,59.69 161.93,61.59 161.93,121.28 162.88,122.24 | IC9.5 162.88,122.24 | v182.88,133.67 IC3.5 | v164.47,133.67 162.88,132.08 162.88,122.24
LRS  (via drill 0.35)
  Top 0.254: v86.36,31.75 96.52,31.75 106.05,22.23 133.35,22.23 133.67,21.91 133.99,21.91 134.3,22.23 135.89,22.23 140.65,17.46 144.78,17.46 R54.1 146.69,16.51 v146.69,15.24 | v68.58,61.91 68.26,61.59 47.62,61.59 IC22.19
  Bottom 0.254: v86.36,31.75 68.58,49.53 v68.58,61.91 | IC3.14 192.72,157.8 159.7,157.8 159.7,60.33 159.07,59.69 159.07,27.62 v146.69,15.24
N$1  (via drill 0.35)
  Top 0.254: v173.04,70.48 174.94,68.58 v208.28,68.58 | IC4.10 214,37.47 210.19,37.47 IC4.13
  Bottom 0.254: IC5.5 IC5.10 IC4.5 IC4.10 | IC5.2 IC5.13 IC4.2 IC4.13 209.23,40.32 209.23,67.63 v208.28,68.58 | IC10.11 173.04,115.89 v173.04,70.48
N$2  (via drill 0.35)
  Top 0.254: IC1.6 181.61,22.86 v181.61,17.14 | v183.2,12.38 183.51,12.06 v208.28,12.06
  Bottom 0.254: v181.61,17.14 183.2,15.56 v183.2,12.38 | v208.28,12.06 209.87,13.65 209.87,30.8 IC4.3
N$3
  Top 0.254: R33.1 D33.2
N$4  (via drill 0.35)
  Top 0.254: IC1.2 182.25,41.27 190.5,41.27 190.82,41.59 199.71,41.59 200.98,40.32 v202.88,40.32 | v203.2,32.07 205.42,29.84 216.53,29.84 IC4.6
  Bottom 0.254: v202.88,40.32 203.2,40.01 v203.2,32.07
N$5  (via drill 0.35)
  Top 0.254: SV_ALU_1.7 15.24,93.98 15.24,97.16 v91.12,97.16 92.39,95.89 114.94,95.89 v116.52,94.3 118.75,96.52 142.56,96.52 143.19,97.16 149.54,97.16 150.5,96.2 v151.13,96.2 | v173.99,84.77 176.53,84.77 177.8,83.5 D27.A | IC19.10 149.86,87.63 145.73,87.63 145.73,90.81 146.37,91.44 147.96,91.44 149.22,92.71 150.18,92.71 150.81,92.08 173.67,92.08 v173.99,92.39 214,92.39 v218.12,88.27
  Bottom 0.254: IC11.10 91.12,89.85 v91.12,97.16 | v116.52,94.3 120.02,90.81 IC17.10 | v173.99,92.39 v173.99,84.77 | IC4.9 218.12,39.69 v218.12,88.27 | v151.13,96.2 151.76,95.57 IC19.10
N$6  (via drill 0.35)
  Top 0.254: v187.32,45.09 187.64,44.77 215.58,44.77 IC4.8
  Bottom 0.254: IC1.15 187.32,38.73 v187.32,45.09
N$7  (via drill 0.35)
  Top 0.254: v188.28,29.53 IC1.11 | v188.28,42.23 188.91,42.86 209.87,42.86 IC4.11
  Bottom 0.254: v188.28,42.23 v188.28,29.53
N$8  (via drill 0.35)
  Top 0.254: v197.8,19.05 198.44,18.41 208.91,18.41 IC5.3
  Bottom 0.254: IC2.6 189.87,24.77 189.87,18.1 192.72,15.24 192.72,5.71 193.99,4.45 197.8,4.45 v197.8,19.05
N$9
  Top 0.254: IC2.2 189.87,34.92 189.87,25.08 193.04,25.08 195.58,22.54 195.58,17.78 215.9,17.78 IC5.6
N$10
  Top 0.254: IC2.15 207.33,36.83 210.5,33.66 218.76,33.66 220.03,32.38 220.03,27.94 IC5.8
N$11  (via drill 0.35)
  Top 0.254: IC2.11 201.93,24.13 v213.36,24.13
  Bottom 0.254: IC5.11 v213.36,24.13
N$12
  Top 0.254: IC1.9 183.51,23.5 183.51,25.08 189.23,25.08 190.18,24.13 IC2.7
N$13  (via drill 0.35)
  Top 0.254: IC39.11 74.3,14.61 v88.58,14.61 | v92.08,11.11 98.74,4.45 v167.32,4.45
  Bottom 0.254: v92.08,11.11 v88.58,14.61 | v167.32,4.45 175.9,13.02 175.9,22.23 IC1.7
N$14  (via drill 0.35)
  Top 0.254: IC1.4 v180.34,29.21
  Bottom 0.254: IC12.18 184.15,20 180.34,23.81 v180.34,29.21
N$15  (via drill 0.35)
  Top 0.254: IC12.17 183.83,16.83 v183.2,16.83
  Bottom 0.254: v183.2,16.83 179.71,20.32 179.71,26.99 178.44,28.26 175.9,28.26 175.9,37.47 IC1.1
N$16
  Top 0.254: R16.1 D16.C
N$17
  Bottom 0.254: IC12.16 187.32,15.88 187.32,29.84 IC1.13
N$18
  Top 0.254: IC12.15 191.77,20.64 188.91,20.64 IC1.10
N$19  (via drill 0.35)
  Top 0.254: IC2.4 v194.31,29.21
  Bottom 0.254: v194.31,29.21 IC12.14
N$20
  Bottom 0.254: IC37.1 62.23,6.35 68.26,6.35 68.26,10.16 67.63,10.79 64.77,10.79 IC39.1
N$21
  Bottom 0.254: IC37.4 55.56,20.64 55.56,15.88 64.45,6.99 67.31,6.99 IC39.2
N$22  (via drill 0.35)
  Top 0.254: IC39.4 68.26,13.02 65.41,13.02 v61.28,17.14
  Bottom 0.254: v61.28,17.14 58.1,20.32 58.1,27.3 57.15,28.26 IC37.10
N$23  (via drill 0.35)
  Top 0.254: IC37.13 51.44,27.3 v72.39,27.3
  Bottom 0.254: v72.39,27.3 73.98,25.72 73.98,9.84 IC39.5
N$24
  Top 0.254: R15.1 D15.C
N$25
  Bottom 0.254: IC39.6 74.93,11.43 IC39.10
N$26
  Bottom 0.254: IC39.3 71.75,6.99 78.42,6.99 78.42,15.56 IC39.9
N$27
  Top 0.254: R34.1 D34.2
N$28
  Top 0.254: R35.1 D35.2
N$29
  Top 0.254: R36.1 D36.2
N$30
  Top 0.254: R40.1 D40.2
N$32  (via drill 0.35)
  Top 0.254: v195.9,37.15 193.68,39.37 IC2.1
  Bottom 0.254: IC12.13 196.22,14.61 196.22,36.83 v195.9,37.15
N$33
  Bottom 0.254: IC12.12 199.39,19.37 197.49,21.27 197.49,29.84 IC2.13
N$34
  Bottom 0.254: IC12.11 201.29,14.61 201.29,22.23 IC2.10
N$35  (via drill 0.35)
  Top 0.254: IC7.1 194.31,106.68 v208.91,106.68
  Bottom 0.254: v208.91,106.68 209.55,107.31 IC6.3
N$36  (via drill 0.35)
  Top 0.254: v195.26,118.43 197.49,120.65 214.63,120.65 IC6.6
  Bottom 0.254: IC7.2 195.26,110.17 v195.26,118.43
N$37
  Top 0.254: IC7.4 201.29,107.31 207.33,107.31 224.16,124.14 224.16,130.81 IC6.8
N$38
  Bottom 0.254: IC7.5 203.84,107.31 208.6,107.31 208.6,127.32 IC6.11
N$39
  Bottom 0.254: IC7.3 195.9,110.17 195.9,118.11 197.17,119.38 204.47,119.38 IC7.9
N$40
  Bottom 0.254: IC7.6 201.93,111.76 IC7.10
N$41  (via drill 0.35)
  Top 0.254: v210.5,115.25 208.91,116.84 IC7.8
  Bottom 0.254: IC12.19 182.25,13.34 182.25,7.94 183.2,6.99 183.2,4.76 184.78,3.17 207.33,3.17 207.33,104.14 210.5,107.31 v210.5,115.25
N$42  (via drill 0.35)
  Top 0.254: v109.86,51.75 110.17,52.07 141.6,52.07 142.88,50.8 143.51,51.44 190.5,51.44 v190.82,51.12
  Bottom 0.254: IC39.12 68.9,15.56 68.9,7.62 72.71,3.81 109.86,3.81 v109.86,51.75 | v190.82,51.12 191.77,52.07 191.77,101.92 198.44,108.58 198.44,115.89 IC7.11
N$43  (via drill 0.35)
  Top 0.254: v71.44,36.2 77.15,41.91 v128.59,41.91 | v144.15,102.87 144.15,104.14 146.05,106.05 146.05,125.09 164.47,125.09 IC9.6
  Bottom 0.254: IC39.13 71.44,20.64 v71.44,36.2 | v128.59,41.91 131.13,44.45 131.13,65.41 130.49,66.04 130.49,89.22 v144.15,102.87
N$44  (via drill 0.35)
  Top 0.254: IC7.13 190.5,120.65 v158.12,120.65
  Bottom 0.254: v158.12,120.65 158.75,121.28 IC9.3
N$45  (via drill 0.35)
  Top 0.254: IC10.1 170.18,113.03 v180.02,113.03
  Bottom 0.254: v180.02,113.03 182.56,115.57 182.56,122.24 IC8.2
N$46  (via drill 0.35)
  Top 0.254: IC10.2 170.81,107.31 182.25,107.31 v186.69,111.76
  Bottom 0.254: IC8.4 v186.69,111.76
N$47
  Top 0.254: IC10.4 IC10.3
N$48  (via drill 0.35)
  Top 0.254: v176.53,106.36 176.85,106.68 186.06,106.68 v191.13,111.76
  Bottom 0.254: v176.53,106.36 IC10.5 | v191.13,111.76 190.82,112.08 190.82,122.24 IC8.6
N$49  (via drill 0.35)
  Top 0.254: v182.25,128.91 192.41,128.91 IC8.8
  Bottom 0.254: IC10.9 180.66,118.43 180.66,127.32 v182.25,128.91
N$50  (via drill 0.35)
  Top 0.254: IC10.10 178.44,114.94 182.88,114.94 v187.64,119.7
  Bottom 0.254: v187.64,119.7 188.28,120.33 188.28,129.86 IC8.10
N$51
  Top 0.254: R1.1 D1.C
N$52
  Top 0.254: IC10.13 170.81,118.75 179.71,118.75 IC10.8
N$53  (via drill 0.35)
  Top 0.254: IC10.6 176.21,112.08 v171.45,112.08
  Bottom 0.254: IC10.12 v171.45,112.08
N$54
  Top 0.254: R42.2 D41.1
N$55  (via drill 0.35)
  Top 0.254: v87.31,83.5 87.63,83.82 91.44,83.82 IC11.6
  Bottom 0.254: IC14.17 87.31,66.99 v87.31,83.5
N$56
  Bottom 0.254: IC14.16 90.49,60.64 95.57,60.64 95.57,68.58 94.93,69.22 94.93,88.58 IC11.8
N$57
  Bottom 0.254: IC14.15 89.53,62.23 90.49,61.28 91.44,61.28 91.44,62.55 91.12,62.87 91.12,68.58 91.76,69.22 91.76,96.84 92.08,97.16 92.08,98.42 90.17,100.33 87.95,100.33 87.95,89.85 IC11.11
N$58  (via drill 0.35)
  Top 0.254: v92.08,67.63 v86.36,67.63
  Bottom 0.254: IC13.3 86.36,69.85 v86.36,67.63 | IC14.14 v92.08,67.63
N$59
  Bottom 0.254: IC14.13 93.34,65.41 IC13.6
N$60
  Bottom 0.254: IC14.12 96.84,64.45 96.84,77.15 IC13.8
N$61  (via drill 0.35)
  Top 0.254: IC14.11 97.79,62.23 v90.49,62.23
  Bottom 0.254: v90.49,62.23 90.49,68.58 89.22,69.85 89.22,77.15 IC13.11
N$62  (via drill 0.35)
  Top 0.254: v139.7,84.45 142.56,84.45 143.19,83.82 144.78,83.82 IC19.3
  Bottom 0.254: IC16.18 142.24,63.5 142.24,62.23 141.29,61.28 139.38,61.28 139.38,84.14 v139.7,84.45
N$63
  Top 0.254: R14.1 D14.C
N$64  (via drill 0.35)
  Top 0.254: v197.17,79.06 197.49,78.74 210.82,78.74 210.82,81.92 209.55,83.19 D21.A | IC25.15 23.5,65.41 v27.62,65.41 28.89,66.67 56.2,66.67 | 76.83,66.67 IC13.1 | 56.2,66.67 76.83,66.67 | v108.27,67.63 107.95,67.31 92.71,67.31 92.08,66.67 76.83,66.67 | v141.6,73.98 141.29,74.3 113.67,74.3 IC18.1 | 56.2,66.67 v56.2,66.99 | v193.36,37.78 189.87,37.78 v187.32,35.24 | v182.88,38.1 180.02,35.24 170.81,35.24 167.64,32.07 161.61,32.07 v157.48,27.94 | v127.95,27.94 v150.18,27.94
  Bottom 0.254: v197.17,79.06 193.68,75.56 193.68,37.78 | 193.68,37.78 193.68,31.11 IC2.5 | IC23.15 56.83,46.67 56.83,62.55 IC22.15 56.2,63.82 v56.2,66.99 | v27.62,65.41 27.62,80.33 IC24.13 | IC18.1 108.27,68.9 108.27,67.94 | v141.6,73.98 IC20.1 | SV_ALU_1.27 40.64,93.98 40.64,95.57 42.23,97.16 62.55,97.16 62.55,88.58 IC13.1 | v193.36,37.78 193.68,37.78 | v187.32,35.24 182.88,35.24 v182.88,38.1 | v150.18,27.94 v157.48,27.94 | v127.95,27.94 111.44,44.45 111.44,64.77 108.27,67.94 | 108.27,67.94 v108.27,67.63
N$65  (via drill 0.35)
  Top 0.254: v199.71,83.5 200.66,84.45 206.06,84.45 207.01,83.5 D22.A | v195.26,36.2 193.36,34.29 IC2.3 | v25.08,82.87 25.4,83.19 27.3,83.19 | IC24.12 27.3,83.19 | 27.3,83.19 35.56,83.19 v40.32,87.95 41.91,86.36 v53.02,86.36 | IC13.4 86.36,72.39 66.99,72.39 66.04,71.44 v60.01,71.44 | v88.58,65.72 88.9,66.04 92.08,66.04 92.71,66.67 117.16,66.67 v117.47,66.99 136.21,66.99 v136.53,66.67 | 149.22,72.39 149.22,73.98 v143.83,73.98 | 149.22,72.39 IC20.4 | v142.88,69.53 141.92,68.58 v137.79,68.58 | v198.12,95.89 197.17,96.84 159.07,96.84 158.43,96.2 v157.48,96.2 | v155.89,73.34 154.94,72.39 149.22,72.39
  Bottom 0.254: v195.26,36.2 194.94,36.51 194.94,46.35 198.12,49.53 198.12,81.92 v199.71,83.5 198.12,85.09 v198.12,95.89 | IC25.14 25.08,64.45 v25.08,82.87 | SV_ALU_1.29 40.32,91.12 v40.32,87.95 | IC23.14 59.37,46.67 59.37,62.55 59.05,62.87 | 59.05,62.87 59.05,70.48 v60.01,71.44 60.01,74.3 57.47,76.83 57.47,81.92 v53.02,86.36 | 59.05,62.87 IC22.14 | v117.47,66.99 IC18.4 | v88.58,65.72 88.27,66.04 IC13.4 | v143.83,73.98 142.88,73.03 v142.88,69.53 | v137.79,68.58 136.53,67.31 v136.53,66.67 | v157.48,96.2 157.8,95.89 157.8,85.09 155.89,83.19 v155.89,73.34
N$66  (via drill 0.35)
  Top 0.254: v203.2,83.5 204.47,83.5 D23.A | v202.25,35.88 200.66,34.29 IC2.14 | IC20.9 156.21,76.2 160.66,76.2 | 160.66,76.2 162.24,76.2 162.88,76.83 201.93,76.83 v202.25,76.52 | v26.67,71.44 28.26,73.03 28.26,76.52 v31.11,76.52 | IC24.11 38.1,81.28 v42.23,85.41 58.1,85.41 v59.37,84.14 | v92.71,74.3 92.39,74.61 72.39,74.61 69.53,77.47 v61.91,77.47 | v160.66,76.83 160.66,76.2 | v160.66,101.28 160.34,100.97 143.83,100.97 v143.51,101.28 | v123.83,95.57 v137.79,95.57
  Bottom 0.254: v203.2,83.5 201.93,82.23 201.93,76.52 | 201.93,76.52 201.93,36.2 v202.25,35.88 | 201.93,76.52 v202.25,76.52 | IC18.9 123.51,79.06 123.51,83.19 123.83,83.5 v123.83,95.57 123.83,100.33 104.46,100.33 94.3,90.17 94.3,79.06 IC13.9 92.71,77.47 v92.71,74.3 | IC23.13 61.91,46.67 61.91,62.55 IC22.13 61.91,64.45 v61.91,77.47 61.91,78.11 59.37,80.64 v59.37,84.14 | v26.67,71.44 IC25.13 | v31.11,76.52 31.75,77.15 IC24.11 | SV_ALU_1.31 42.23,90.49 v42.23,85.41 | v160.66,101.28 v160.66,76.83 | v137.79,95.57 v143.51,101.28
N$67  (via drill 0.35)
  Top 0.254: IC23.11 IC23.12 | IC25.12 31.11,65.41 46.67,65.41 | 46.67,65.41 61.59,65.41 IC22.12 | 46.67,65.41 v46.67,65.09 | v200.66,83.5 201.93,83.5 D24.A | v110.49,76.2 87.63,76.2 IC13.12 83.82,80.01 80.33,80.01 79.69,79.38 v50.8,79.38 | IC20.12 144.78,80.01 v143.83,80.01 | v115.89,85.72 139.38,85.72 140.02,85.09 v142.88,85.09 v148.59,85.09 | v200.03,97.16 192.41,104.78 v154.94,104.78
  Bottom 0.254: IC24.18 16.51,83.82 28.26,83.82 28.26,65.72 29.21,64.77 IC25.12 | SV_ALU_1.33 46.67,92.39 46.67,79.38 | v46.67,65.09 46.67,79.38 | IC23.12 64.45,46.67 64.45,57.15 63.82,57.78 63.82,63.18 IC22.12 | IC2.12 201.29,31.11 201.29,82.87 v200.66,83.5 200.03,84.14 v200.03,97.16 | v110.49,76.2 113.35,76.2 113.35,82.55 114.62,83.82 115.89,83.82 | 115.89,83.82 115.89,79.06 IC18.12 | v143.83,80.01 142.88,80.96 v142.88,85.09 | 115.89,83.82 v115.89,85.72 | v154.94,104.78 154.31,104.14 149.22,104.14 149.22,96.52 149.54,96.2 149.54,92.08 148.27,90.81 148.27,85.41 v148.59,85.09 | v50.8,79.38 46.67,79.38
N$68
  Top 0.254: R2.1 D2.C
N$69  (via drill 0.35)
  Top 0.254: v208.28,82.55 191.13,82.55 190.5,83.19 D32.A | IC18.13 114.3,76.2 129.22,76.2 133.03,80.01 142.24,80.01 IC20.13 146.05,76.2 147.64,76.2 147.64,82.55 148.91,83.82 149.86,83.82 v151.13,85.09 | SV_ALU_1.17 29.21,90.17 v74.61,90.17 79.06,94.61 111.12,94.61 v111.44,94.3 | v208.28,93.34 196.22,105.41 162.88,105.41 153.99,114.3 152.72,114.3 152.4,113.98 v152.4,101.92
  Bottom 0.254: IC5.12 211.77,28.89 211.77,33.02 209.87,34.92 209.87,80.96 v208.28,82.55 v208.28,93.34 | IC13.13 81.6,79.69 81.6,83.19 v74.61,90.17 | IC18.13 111.44,79.06 v111.44,94.3 | v152.4,101.92 152.72,101.6 152.72,87 151.13,85.41 v151.13,85.09
N$70  (via drill 0.35)
  Top 0.254: IC15.17 116.84,66.04 v120.02,66.04
  Bottom 0.254: v120.02,66.04 120.97,66.99 120.97,76.2 121.6,76.83 121.6,79.69 122.56,80.64 IC17.6
N$71
  Top 0.254: R13.1 D13.C
N$72
  Top 0.254: R12.1 D12.C
N$73
  Bottom 0.254: IC15.16 117.79,63.82 117.79,63.18 119.7,61.28 121.6,61.28 121.6,74.93 124.14,77.47 124.14,83.19 125.09,84.14 IC17.8
N$74
  Bottom 0.254: IC15.15 119.06,65.09 119.06,86.68 117.47,88.27 IC17.11
N$75
  Bottom 0.254: IC18.3 115.57,69.85 115.57,65.72 116.52,64.77 116.52,62.87 118.75,60.64 122.56,60.64 IC15.14
N$76
  Bottom 0.254: IC15.13 122.56,66.67 IC18.6
N$77
  Top 0.254: R38.1 D38.1
N$78
  Top 0.254: R37.1 D37.1
N$79  (via drill 0.35)
  Top 0.254: 83.5,84.77 84.77,86.04 97.16,86.04 97.47,85.72 105.41,85.72 109.22,81.92 IC17.1 | 83.5,84.77 IC11.1 | IC24.17 18.41,79.38 v29.53,79.38 | 83.5,84.77 80.64,87.63 55.24,87.63 53.34,89.53 28.26,89.53 25.4,92.39 25.4,93.98 27.94,93.98 SV_ALU_1.19 | D17.A 219.71,83.5 217.49,85.72 v180.66,85.72 151.45,85.72 151.13,86.04 v142.24,86.04 140.65,87.63 113.67,87.63 v113.35,87.95
  Bottom 0.254: SV_ALU_1.19 29.21,91.44 30.16,90.49 30.16,80.01 v29.53,79.38 29.53,77.15 30.8,75.88 30.8,64.45 IC25.11 | v142.24,86.04 141.6,85.41 IC19.1 | IC1.5 180.66,32.07 v180.66,85.72 | IC17.1 110.81,82.87 110.81,93.98 110.49,94.3 111.44,95.25 113.35,95.25 v113.35,87.95
N$80  (via drill 0.35)
  Top 0.254: 10.16,67.31 6.03,71.44 6.03,83.19 17.14,83.19 IC24.16 21.59,83.82 28.57,83.82 v31.75,87 | 10.16,67.31 IC25.18 | v48.58,67.63 48.26,67.31 10.16,67.31 | v89.22,92.39 89.53,92.08 116.2,92.08 v116.52,92.39 | v179.71,84.45 180.34,84.45 180.97,85.09 215.58,85.09 217.17,83.5 D18.A | IC19.4 151.13,80.01 170.5,80.01 171.77,78.74 178.75,78.74 179.07,79.06 179.07,80.96 v179.39,80.96 | v116.52,67.63 116.84,67.94 137.48,67.94 138.75,66.67 v145.41,66.67 | v33.02,98.74 33.34,99.06 87.95,99.06 v88.9,98.11
  Bottom 0.254: IC23.18 48.9,46.35 48.9,54.29 49.21,54.61 49.21,62.55 IC22.18 48.58,63.82 v48.58,67.63 | v31.75,87 SV_ALU_1.21 33.02,93.98 v33.02,98.74 | IC11.4 88.9,82.55 88.9,87.95 89.22,88.27 v89.22,92.39 89.22,97.79 v88.9,98.11 | v116.52,92.39 116.52,86.04 117.47,85.09 IC17.4 116.52,80.96 v116.52,67.63 | v179.71,84.45 180.02,84.14 180.02,80.96 | 180.02,80.96 180.02,36.51 IC1.3 | 180.02,80.96 v179.39,80.96 | v145.41,66.67 148.27,69.53 148.27,80.96 IC19.4
N$81  (via drill 0.35)
  Top 0.254: v213.36,83.5 214.63,83.5 D19.A | v210.19,86.68 v196.22,86.68 161.29,86.68 160.34,87.63 156.21,87.63 IC19.9 | IC1.14 189.87,38.73 189.87,40.64 v190.82,40.64 | v93.34,93.03 93.66,92.71 115.89,92.71 116.52,93.34 | v122.56,93.34 116.52,93.34 | SV_ALU_1.23 35.56,91.44 51.44,91.44 v51.75,91.12 52.07,90.81 65.41,90.81 69.85,95.25 114.62,95.25 116.52,93.34 | v154.31,98.11 153.35,99.06 123.19,99.06 v122.87,98.74
  Bottom 0.254: v210.19,86.68 v213.36,83.5 | v190.82,40.64 193.04,42.86 193.04,83.5 v196.22,86.68 | v93.34,93.03 IC11.9 | IC17.9 v122.56,93.34 122.56,98.42 v122.87,98.74 | IC23.17 51.75,46.67 51.75,62.55 IC22.17 51.75,64.45 v51.75,91.12 | IC25.17 15.56,64.45 15.56,74.93 | 15.56,74.93 15.56,75.25 IC24.15 | SV_ALU_1.23 35.56,93.98 35.56,97.16 32.38,100.33 12.7,100.33 12.7,84.77 10.48,82.55 10.48,80.01 15.56,74.93 | v154.31,98.11 IC19.9
N$82  (via drill 0.35)
  Top 0.254: 182.56,91.76 174.31,91.76 173.99,91.44 150.18,91.44 | 182.56,91.76 206.06,91.76 210.5,87.31 220.66,87.31 220.66,82.87 220.34,82.55 212.72,82.55 212.09,83.19 D20.A | 150.18,91.44 148.59,91.44 IC19.12 | 182.56,91.76 v182.56,91.44 | v53.34,67.63 52.39,68.58 v36.83,68.58 v20.64,68.58 | v63.5,92.71 62.23,93.98 38.1,93.98 SV_ALU_1.25 | v114.3,93.66 113.98,93.34 93.98,93.34 93.34,93.98 87,93.98 v85.41,92.39 | v150.18,91.76 150.18,91.44 | v150.18,98.11 149.86,98.42 123.51,98.42 122.87,97.79 v118.11,97.79
  Bottom 0.254: IC1.12 181.29,33.34 181.29,57.47 182.56,58.74 v182.56,91.44 | IC23.16 54.29,46.67 54.29,62.55 IC22.16 v53.34,67.63 | IC25.16 20.64,65.09 v20.64,68.58 20.64,77.79 IC24.14 | 84.14,91.12 82.55,92.71 v63.5,92.71 | 84.14,91.12 IC11.12 | IC17.12 114.3,90.17 v114.3,93.66 114.3,93.98 v118.11,97.79 | 84.14,91.12 v85.41,92.39 | SV_ALU_1.25 v36.83,68.58 | v150.18,98.11 v150.18,91.76
N$83
  Bottom 0.254: IC15.12 127.32,64.45 127.32,75.88 IC18.8
N$84  (via drill 0.35)
  Top 0.254: IC15.11 128.27,62.23 v119.7,62.23
  Bottom 0.254: v119.7,62.23 118.43,63.5 118.43,77.15 IC18.11
N$85
  Bottom 0.254: IC15.18 113.98,65.72 113.98,80.96 IC17.3
N$86
  Bottom 0.254: IC16.17 149.22,67.94 151.13,67.94 151.13,68.9 150.81,69.22 150.81,74.93 153.35,77.47 153.35,80.96 IC19.6
N$87  (via drill 0.35)
  Top 0.254: IC16.16 146.05,62.23 v141.29,62.23 | v140.65,75.25 140.97,74.93 143.83,74.93 144.15,74.61 153.99,74.61 v154.31,74.3
  Bottom 0.254: v141.29,62.23 141.29,68.58 140.65,69.22 v140.65,75.25 | v154.31,74.3 155.26,75.25 155.26,87 156.84,88.58 IC19.8
N$88  (via drill 0.35)
  Top 0.254: v151.13,76.2 v153.35,76.2
  Bottom 0.254: IC16.15 153.35,66.99 v153.35,76.2 | v151.13,76.2 150.18,77.15 150.18,88.58 IC19.11
N$89
  Top 0.254: IC20.3 146.69,66.04 148.27,66.04 149.54,64.77 149.54,62.23 151.13,62.23 IC16.14
N$90
  Bottom 0.254: IC16.13 155.57,69.22 IC20.6
N$91
  Bottom 0.254: IC16.12 157.8,64.45 157.8,72.39 156.84,73.34 IC20.8
N$92  (via drill 0.35)
  Top 0.254: v160.66,68.58 153.35,68.58 153.03,68.9 152.4,68.9 152.08,68.58 150.5,68.58 v150.18,68.9
  Bottom 0.254: v160.66,68.58 IC16.11 | v150.18,68.9 150.18,76.52 149.22,77.47 IC20.11
N$93  (via drill 0.35)
  Top 0.254: 61.28,83.82 60.64,83.19 50.16,83.19 IC21.18 | 61.28,83.82 R41.1 | v65.09,82.87 64.14,83.82 61.28,83.82
  Bottom 0.254: IC22.11 65.09,64.45 v65.09,82.87
N$94
  Top 0.254: IC9.13 158.12,128.91 161.93,128.91 IC9.10 IC9.9
N$95
  Bottom 0.254: IC14.18 84.77,66.99 84.77,80.96 IC11.3
N$96
  Top 0.254: R43.2 D42.1
N$97
  Top 0.254: R44.2 D43.1
N$98
  Top 0.254: R45.2 D44.1
N$99
  Top 0.254: R46.2 D45.1
N$100
  Top 0.254: R47.2 D46.1
N$101
  Top 0.254: R48.2 D47.1
N$102
  Top 0.254: R49.2 D48.1
N$103
  Top 0.254: R50.2 D49.1
N$104
  Top 0.254: R51.2 D50.1
N$105
  Top 0.254: R52.2 D51.1
N$106
  Top 0.254: R53.2 D52.1
N$107
  Top 0.254: R54.2 D53.1
N$108
  Top 0.254: R55.2 D54.1
N$109
  Top 0.254: R56.2 D55.1
N$110
  Top 0.254: R57.2 D56.1
N$119  (via drill 0.35)
  Top 0.254: IC11.2 85.09,80.01 110.49,80.01 IC17.2 114.3,80.01 132.4,80.01 135.89,83.5 140.97,83.5 141.29,83.82 142.24,83.82 IC19.2 | SV_ALU_1.3 13.65,87.95 v32.7,87.95 | v164.78,84.77 171.45,84.77 172.72,83.5 D25.A | v143.19,93.34 163.51,93.34 v163.83,93.03 171.45,93.03 171.77,93.34 173.99,93.34 174.31,93.03 204.79,93.03 v205.1,93.34
  Bottom 0.254: v32.7,87.95 35.56,90.81 35.56,93.03 36.51,93.98 38.1,93.98 38.1,95.57 40.32,97.79 86.36,97.79 86.36,91.12 86.68,90.81 86.68,85.41 IC11.2 | v164.78,84.77 163.83,85.72 v163.83,93.03 | v143.19,93.34 143.19,85.72 144.15,84.77 IC19.2 | IC4.1 204.79,32.7 204.79,93.03 v205.1,93.34
N$120  (via drill 0.35)
  Top 0.254: 175.26,83.19 174.62,82.55 v158.75,82.55 | v157.48,83.82 153.67,83.82 IC19.5 | v213.36,41.59 210.82,44.13 v177.8,44.13 | 175.26,83.19 v176.53,81.92 | 175.26,83.19 D26.A | v96.84,84.77 v90.81,84.77 87.63,84.77 v87.31,85.09 | v107.31,84.77 108.27,83.82 118.11,83.82 IC17.5 | SV_ALU_1.5 12.7,93.98 12.7,97.79 86.68,97.79 v87,98.11 | v158.43,97.16 150.18,97.16 149.54,97.79 123.51,97.79 122.87,97.16 118.43,97.16 118.11,96.84 v110.81,96.84
  Bottom 0.254: v158.75,82.55 v157.48,83.82 158.43,84.77 v158.43,97.16 | IC4.4 214.31,32.7 214.31,40.64 v213.36,41.59 | v177.8,44.13 178.12,44.45 178.12,80.33 v176.53,81.92 | v90.81,84.77 IC11.5 | v107.31,84.77 101.6,84.77 | 101.6,84.77 v96.84,84.77 | v87,98.11 87.31,97.79 v87.31,85.09 | v110.81,96.84 101.6,87.63 101.6,84.77
N$122  (via drill 0.35)
  Top 0.254: 180.34,83.19 181.61,81.92 181.61,78.74 195.9,78.74 197.17,80.01 v199.07,80.01 | v200.34,41.91 200.98,41.27 208.91,41.27 IC4.12 | IC11.13 85.09,91.44 110.49,91.44 | IC17.13 110.49,91.44 | IC19.13 142.24,91.44 110.49,91.44 | SV_ALU_1.9 20.32,88.9 53.34,88.9 55.56,86.68 v80.33,86.68 | 180.34,83.19 179.71,82.55 177.16,82.55 v176.53,83.19 | v176.53,94.3 175.9,94.93 157.8,94.93 157.48,94.61 144.46,94.61 v144.15,94.93 | 180.34,83.19 D28.A
  Bottom 0.254: v199.07,80.01 200.34,78.74 v200.34,41.91 | IC11.13 v80.33,86.68 | v176.53,94.3 v176.53,83.19 | IC19.13 v144.15,94.93
N$123  (via drill 0.35)
  Top 0.254: v192.72,84.14 189.87,84.14 189.55,83.82 189.55,83.5 188.59,82.55 183.51,82.55 182.88,83.19 D29.A | IC13.2 85.09,68.58 110.49,68.58 | IC18.2 110.49,68.58 | IC20.2 142.24,72.39 137.79,72.39 | 137.79,72.39 129.22,72.39 125.41,68.58 110.49,68.58 | SV_ALU_1.11 20.32,93.98 20.32,96.52 60.64,96.52 v65.41,91.76 | v192.72,95.89 192.41,95.57 157.8,95.57 157.48,95.25 144.78,95.25 144.15,95.89 143.83,95.89 v143.19,95.25 | 137.79,72.39 v137.79,72.07
  Bottom 0.254: v192.72,84.14 197.17,88.58 197.17,95.89 | 197.17,95.89 199.39,98.11 204.15,98.11 204.15,21.91 IC5.1 | v65.41,91.76 79.69,77.47 79.69,73.98 IC13.2 | v192.72,95.89 197.17,95.89 | v143.19,95.25 137.79,89.85 v137.79,72.07
N$124  (via drill 0.35)
  Top 0.254: v184.15,83.5 185.42,83.5 D30.A | v184.15,75.88 182.56,74.3 162.88,74.3 | 162.88,74.3 155.26,74.3 154.31,73.34 v152.4,73.34 | v215.26,54.29 210.82,58.74 v188.28,58.74 | v102.55,87.63 v89.85,87.63 | v22.86,98.74 24.45,100.33 89.22,100.33 | v90.17,99.38 89.22,100.33 | v162.88,75.88 162.88,74.3 | v162.88,98.42 160.97,100.33 89.22,100.33
  Bottom 0.254: v184.15,83.5 v184.15,75.88 185.74,74.3 185.74,61.28 v188.28,58.74 | v152.4,73.34 151.76,72.71 IC20.5 | IC5.4 214.95,21.91 214.95,48.58 215.26,48.9 v215.26,54.29 | IC13.5 89.85,71.44 v89.85,87.63 89.85,90.81 90.17,91.12 v90.17,99.38 | v102.55,87.63 114.62,99.69 121.6,99.69 121.6,80.33 120.97,79.69 120.97,76.83 120.02,75.88 IC18.5 | SV_ALU_1.13 22.86,93.98 v22.86,98.74 | v162.88,98.42 v162.88,75.88
N$125  (via drill 0.35)
  Top 0.254: v188.91,84.14 188.59,84.14 187.96,83.5 D31.A | v189.87,75.88 196.22,69.53 v211.46,69.53 | v90.81,73.66 91.12,73.34 96.52,73.34 97.47,74.3 v99.69,74.3 | v29.21,99.38 29.53,99.69 88.9,99.69 90.17,98.42 117.79,98.42 118.11,98.74 v120.65,98.74 121.6,99.69 153.99,99.69 v155.57,98.11 158.43,98.11 159.07,97.47 199.07,97.47 199.07,95.89 198.12,94.93 190.82,94.93 v189.87,93.98
  Bottom 0.254: v189.87,75.88 189.87,83.19 v188.91,84.14 189.87,85.09 v189.87,93.98 | v211.46,69.53 217.49,63.5 217.49,28.89 IC5.9 | v90.81,73.66 IC13.10 | v99.69,74.3 108.27,82.87 108.27,92.71 114.3,98.74 v120.65,98.74 120.97,98.74 120.97,80.33 120.02,79.38 IC18.10 | IC20.10 152.72,79.06 152.72,85.09 155.57,87.95 v155.57,98.11 | SV_ALU_1.15 25.4,93.98 25.4,95.57 v29.21,99.38
N$129  (via drill 0.35)
  Top 0.254: v186.69,65.72 187.96,65.72 D2.A | 110.49,54.61 83.82,54.61 IC14.3 80.01,54.61 69.53,54.61 v67.63,56.52 | IC15.3 110.49,54.61 | IC16.3 142.24,55.88 141.92,55.88 140.65,54.61 110.49,54.61 | v23.18,54.29 21.91,53.02 16.83,53.02 IC25.3 | IC36.4 27.3,38.73 v40.32,38.73 | v66.36,57.78 50.16,57.78 IC22.3 | v186.06,50.48 185.74,50.8 143.51,50.8 142.88,50.16 v141.92,50.16
  Bottom 0.254: v186.69,65.72 189.23,63.18 189.23,50.48 | 189.23,50.48 189.23,16.19 190.18,15.24 190.18,9.53 187.64,6.99 187.64,5.08 187.01,4.45 184.15,4.45 IC12.3 | IC25.3 13.02,56.83 13.02,72.71 IC24.3 | IC36.4 23.18,42.86 v23.18,54.29 | IC37.3 51.12,22.54 51.12,35.24 IC23.3 47.31,39.05 | 47.31,54.93 IC22.3 | 47.31,39.05 47.31,54.93 | IC21.3 47.62,73.03 47.62,65.09 47.31,64.77 47.31,54.93 | v40.32,38.73 42.86,36.2 47.31,36.2 47.31,39.05 | v66.36,57.78 v67.63,56.52 | v186.06,50.48 189.23,50.48 | v141.92,50.16 141.92,53.98 142.88,54.93 IC16.3
N$130  (via drill 0.35)
  Top 0.254: v184.15,65.72 185.42,65.72 D3.A | v183.2,49.85 182.88,50.16 145.73,50.16 v145.41,49.85 | v183.51,33.97 v183.51,30.16 | v49.85,48.58 v80.01,48.58 111.76,48.58 v112.39,49.21 v134.3,49.21 | IC24.4 20.64,69.53 v49.85,69.53 | v134.62,59.37 v145.41,59.37
  Bottom 0.254: v184.15,65.72 183.2,64.77 v183.2,49.85 181.93,48.58 181.93,35.56 v183.51,33.97 | v145.41,49.85 IC16.4 v145.41,59.37 | IC12.4 185.1,7.94 185.1,19.68 183.51,21.27 v183.51,30.16 | IC36.7 IC25.4 17.46,56.83 17.46,72.71 IC24.4 | 49.85,54.93 v49.85,48.58 49.85,39.05 IC23.4 53.02,35.88 53.02,28.57 56.83,24.77 56.83,21.91 IC37.5 | IC22.4 49.85,54.93 | IC21.4 49.85,72.71 v49.85,69.53 49.85,54.93 | IC14.4 80.01,52.07 v80.01,48.58 | IC15.4 112.39,53.98 v112.39,49.21 | v134.62,59.37 134.3,59.05 v134.3,49.21
N$131  (via drill 0.35)
  Top 0.254: v181.61,65.72 182.88,65.72 D4.A | v181.61,58.74 177.48,54.61 172.4,54.61 | 172.4,54.61 149.86,54.61 IC16.5 146.05,54.61 142.24,54.61 v141.92,54.93 | IC12.5 186.69,8.89 176.53,8.89 v172.4,13.02 | 172.4,54.61 v172.4,54.93 | v116.84,40.01 114.94,38.1 82.55,38.1 v82.23,37.78 79.06,34.61 56.83,34.61 IC23.5 51.44,36.2 42.86,36.2 41.27,37.78 18.1,37.78 IC36.8 v18.41,46.35 | v138.75,49.21 137.79,48.26 v116.84,48.26
  Bottom 0.254: v181.61,58.74 v181.61,65.72 | v172.4,54.93 v172.4,13.02 | IC24.5 18.1,72.71 18.1,56.83 IC25.5 18.41,55.24 v18.41,46.35 | 52.39,54.93 52.39,39.05 IC23.5 58.1,33.34 58.1,27.94 58.74,27.3 58.74,22.54 IC37.6 | IC22.5 52.39,54.93 | IC21.5 52.39,72.71 52.39,54.93 | IC14.5 82.23,51.75 v82.23,37.78 | IC15.5 116.84,55.88 v116.84,48.26 v116.84,40.01 | v141.92,54.93 138.75,51.75 v138.75,49.21
N$132
  Top 0.254: R11.1 D11.C
N$133
  Top 0.254: R10.1 D10.C
N$134
  Top 0.254: R9.1 D9.C
N$136
  Top 0.254: R3.1 D3.C
N$137
  Top 0.254: R4.1 D4.C
N$138
  Top 0.254: R5.1 D5.C
N$139
  Top 0.254: R6.1 D6.C
N$140
  Top 0.254: R7.1 D7.C
N$141
  Top 0.254: R8.1 D8.C
N$142
  Top 0.254: R17.1 D17.C
N$143
  Top 0.254: R18.1 D18.C
N$144
  Top 0.254: R19.1 D19.C
N$145
  Top 0.254: R20.1 D20.C
N$146
  Top 0.254: R21.1 D21.C